# Altium schematic sheet [06] - MICRO CONTROLLER CONNECTORS.SchDoc (part 3 of 3)
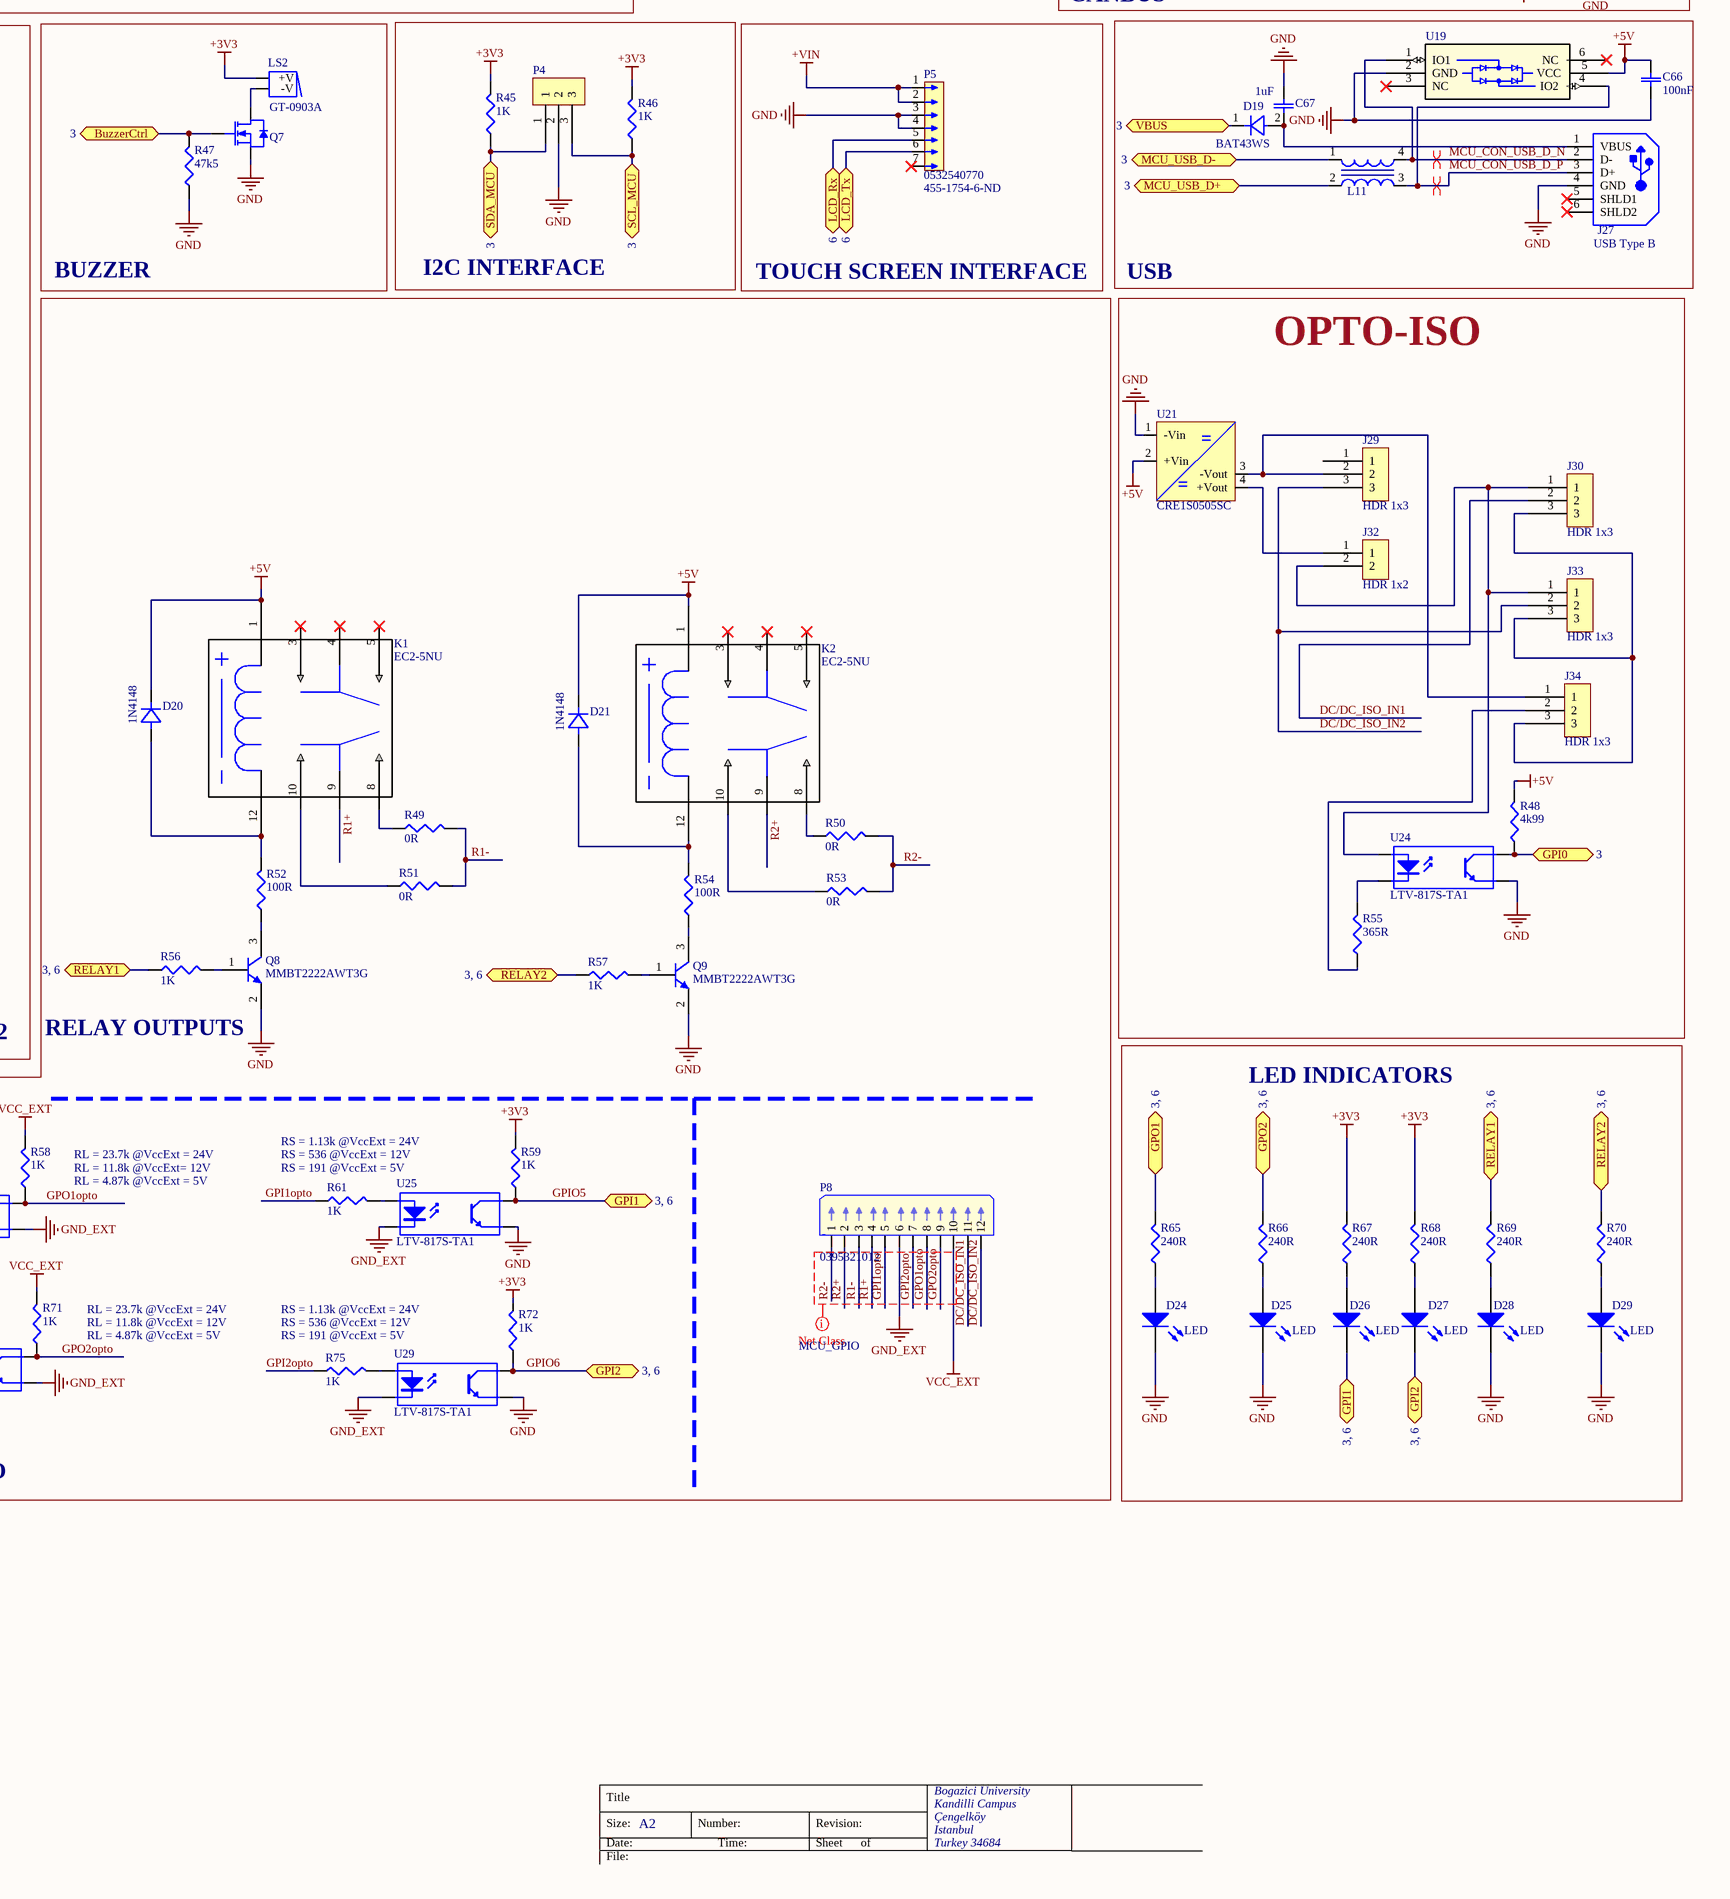
[diagram p5: [06] - MICRO CONTROLLER CONNECTORS.SchDoc, bottom right]

## Library data of the parts (continued)
R59 R61 R62 R71-R73 R75 = ERJ-2RKF1001X: RES SMD 1K OHM 1% 1/10W 0402; Manufacturer 1: Panasonic Electronic Components; Power (Watts): 0.1W, 1/10W; Temperature Coefficient: ±100ppm/°C; Category: Resistors; Package / Case: 0402 (1005 Metric); Tolerance: ±1%; Supplier 1: Digi-Key; Supplier Part Number 1: P1.00KLDKR-ND; RoHS: RoHS Compliant; Stock 1: 18630560; Pricing 1: 1=0.1, 10=0.056, 100=0.0227, 1000=0.01021, 2500=0.00886, 5000=0.00732 (USD); Composition: Thick Film; Features: Automotive AEC-Q200; Size / Dimension: 0.039" L x 0.020" W (1.00mm x 0.50mm); Packaging: Digi-Reel®; ComponentLink1URL: https://industrial.panasonic.com/cdbs/www-data/pdf/RDA0000/AOA0000C304.pdf; ComponentLink1Description: https://industrial.panasonic.com/cdbs/www-data/pdf/RDA0000/AOA0000C304.pdf; Manufacturer Part Number 1: ERJ-2RKF1001X; Part Status: Active; Operating Temperature: -55°C ~ 155°C; Supplier Device Package: 0402; Height - Seated (Max): 0.016" (0.40mm); Failure Rate: -; Description 1: RES SMD 1K OHM 1% 1/10W 0402
R65-R70 = RMCF0402FT240R: RES TF 240 OHM 1% 0.0625W 0402; Manufacturer: Stackpole Electronics Inc; Resistance (Ohms): 240; Power (Watts): 0.063W, 1/16W; .Checked SCH: CHK; Temperature Coefficient: ±100ppm/°C; Category: Resistors; Supplier Part Number: RMCF0402FT240RCT-ND; Manufacturer Part Number: RMCF0402FT240R; Package / Case: 0402 (1005 Metric); Price 1k [$]: 0.00384; Tolerance: ±1%; Value: 240R; Supplier: Digikey; Supplier 1: Digi-Key; Supplier Part Number 1: RMCF0402FT240RCT-ND; RoHS: RoHS Compliant; Stock 1: 39860; Pricing 1: 1=0.04, 10=0.025, 50=0.0138, 100=0.0105, 250=0.0078, 500=0.00576, 1000=0.00384 (USD); Composition: Thick Film; Features: -; Size / Dimension: 0.039" L x 0.020" W (1.00mm x 0.50mm); Height: 0.016" (0.40mm); Number of Terminations: 2; Packaging: Cut Tape (CT); ComponentLink1URL: http://www.seielect.com/Catalog/SEI-RMCF.pdf; ComponentLink1Description: http://www.seielect.com/Catalog/SEI-RMCF.pdf
U18 = SN65HVD1050DR: IC EMC CAN TRANSCEIVER 8-SOIC; Manufacturer: Texas Instruments; Built_By: EMA_UL_Team; C: Copyright (C) 2015 Accelerated Designs. All rights reserved; Protocol: CANbus; Number of Drivers/Receivers: 1/1; Duplex: Half; Voltage - Supply: 4.5 V ~ 5.5 V; .Checked SCH: CHK; Vendor: Texas Instruments; Manufacturer_Part_Number: SN65HVD1050DR; RefDes: RefDes; Type: DEV; Value: Value; Manufacturer 1: Texas Instruments; Manufacturer Part Number 1: SN65HVD1050DR; RoHS: RoHS Compliant; Stock 1: 82774; Pricing 1: 1=1.36, 10=1.215, 100=0.9476, 500=0.7828, 1000=0.618 (USD); Packaging: Cut Tape (CT); Part Status: Active; Data Rate: -; Operating Temperature: -40°C ~ 125°C; Mounting Type: Surface Mount; Package / Case: 8-SOIC (0.154", 3.90mm Width); Supplier Device Package: 8-SOIC; Base Part Number: SN65HVD1050; ComponentLink1URL: http://www.ti.com/lit/ds/symlink/sn65hvd1050.pdf; ComponentLink1Description: http://www.ti.com/lit/ds/symlink/sn65hvd1050.pdf; Supplier 1: Digi-Key; Supplier Part Number 1: 296-26335-1-ND; Description 1: IC EMC CAN TRANSCEIVER 8-SOIC; Category: Integrated Circuits (ICs)
U19 = MAX3207EAUT+T: MAX3207E; Manufacturer 1: Maxim Integrated; Vendor: Maxim Integrated Products; Built_By: EMA_UL_Team; C: Copyright (C) 2015 Accelerated Designs. All rights reserved; Power Line Protection: Yes; Description 1: TVS DIODE SOT23-6; .Checked SCH: CHK; Manufacturer_Part_Number: MAX3207EAUT+T; RefDes: RefDes; Type: DEV; Value: Value; Manufacturer Part Number 1: MAX3207EAUT+T; RoHS: RoHS Compliant; Stock 1: 8902; Pricing 1: 1=1.3, 10=1.224, 25=0.9792, 50=0.9302, 100=0.8568, 250=0.81276, 500=0.78336 (USD); Packaging: Cut Tape (CT); Part Status: Active; Voltage - Reverse Standoff (Typ): -; Voltage - Breakdown (Min): -; Voltage - Clamping (Max) @ Ipp: -; Current - Peak Pulse (10/1000µs): -; Power - Peak Pulse: -; Applications: USB OTG; Capacitance @ Frequency: -; Operating Temperature: -40°C ~ 125°C (TA); Mounting Type: Surface Mount; Package / Case: SOT-23-6; Supplier Device Package: SOT-23-6; Base Part Number: MAX3207E; ComponentLink1URL: https://datasheets.maximintegrated.com/en/ds/MAX3205E-MAX3208E.pdf; ComponentLink1Description: https://datasheets.maximintegrated.com/en/ds/MAX3205E-MAX3208E.pdf; Supplier 1: Digi-Key; Supplier Part Number 1: MAX3207EAUT+TCT-ND; Category: Circuit Protection
U20 = ST3222: ST Dual RS232 Transceiver; Manufacturer 1: STMicroelectronics; Manufacturer Part Number 1: ST3222BTR; .Checked SCH: CHK; Description 1: IC DRIVER/RCVR RS232 LP 20-TSSOP; Number of Drivers/Receivers: 2/2; Duplex: Full; Data Rate: 250kbps; Voltage - Supply: 3 V ~ 3.6 V; Digikey P/N: 497-5845-2-ND; Supplier 1: Digi-Key; RoHS: RoHS Compliant; Category: Integrated Circuits (ICs); Stock 1: 3064; Pricing 1: 1=1.32, 10=1.183, 100=0.9225, 500=0.76206, 1000=0.60162 (USD); Packaging: Digi-Reel®; Part Status: Active; Type: Transceiver; Protocol: RS232; Operating Temperature: -40°C ~ 85°C; Mounting Type: Surface Mount; Package / Case: 20-TSSOP (0.173", 4.40mm Width); Supplier Device Package: 20-TSSOP; Base Part Number: ST3222; ComponentLink1URL: http://www.st.com/content/ccc/resource/technical/document/datasheet/a7/2a/91/f8/35/8c/40/de/CD00002292.pdf/files/CD00002292.pdf/jcr:content/translations/en.CD00002292.pdf; ComponentLink1Description: http://www.st.com/content/ccc/resource/technical/document/datasheet/a7/2a/91/f8/35/8c/40/de/CD00002292.pdf/files/CD00002292.pdf/jcr:content/translations/en.CD00002292.pdf
U21 = CRE1S0505SC: DC/DC TH 1W 5-5V SIP SINGLE; Manufacturer 1: Murata Power Solutions Inc.; Voltage - Input (Min): 4.5V; Voltage - Input (Max): 5.5V; Voltage - Output 1: 5V; Current - Output (Max): 200mA; Efficiency: 70%; .Checked SCH: CHK; Manufacturer Part Number 1: CRE1S0505SC; RoHS: RoHS Compliant; Stock 1: 676; Pricing 1: 1=2.69, 5=2.68, 10=2.66, 25=2.63, 50=2.56, 100=2.43, 250=2.28, 500=2.13002, 1000=2.1147 (USD); Packaging: Tube; Part Status: Active; Type: Isolated Module; Voltage - Output 2: -; Voltage - Output 3: -; Applications: ITE (Commercial); Features: -; Operating Temperature: -40°C ~ 85°C; Mounting Type: Through Hole; Package / Case: 4-SIP Module; Size / Dimension: 0.45" L x 0.24" W x 0.30" H (11.5mm x 6.1mm x 7.5mm); Supplier Device Package: -; ComponentLink1URL: https://power.murata.com/data/power/ncl/kdc_cre1.pdf; ComponentLink1Description: https://power.murata.com/data/power/ncl/kdc_cre1.pdf; Supplier 1: Digi-Key; Supplier Part Number 1: 811-3196-ND; Description 1: DC/DC TH 1W 5-5V SIP SINGLE; Category: Power Supplies - Board Mount
U22 = ST3222: ST Dual RS232 Transceiver; Manufacturer: STMicroelectronics; Manufacturer Part Number: ST3222BTR; Number of Drivers/Receivers: 2/2; Duplex: Full; Data Rate: 250kbps; Voltage - Supply: 3 V ~ 3.6 V; .Checked SCH: CHK; Description 2: IC DRIVER/RCVR RS232 LP 20-TSSOP; Digikey P/N: 497-5845-2-ND; Supplier 1: Digi-Key; RoHS: RoHS Compliant; Category: Integrated Circuits (ICs); Stock 1: 3074; Pricing 1: 1=1.32, 10=1.183, 100=0.9225, 500=0.76206, 1000=0.60162 (USD); Packaging: Cut Tape (CT); Part Status: Active; Type: Transceiver; Protocol: RS232; Operating Temperature: -40°C ~ 85°C; Mounting Type: Surface Mount; Package / Case: 20-TSSOP (0.173", 4.40mm Width); Supplier Device Package: 20-TSSOP; Base Part Number: ST3222; ComponentLink1URL: http://www.st.com/content/ccc/resource/technical/document/datasheet/a7/2a/91/f8/35/8c/40/de/CD00002292.pdf/files/CD00002292.pdf/jcr:content/translations/en.CD00002292.pdf; ComponentLink1Description: http://www.st.com/content/ccc/resource/technical/document/datasheet/a7/2a/91/f8/35/8c/40/de/CD00002292.pdf/files/CD00002292.pdf/jcr:content/translations/en.CD00002292.pdf; Supplier Part Number 1: 497-5845-1-ND; Supplier 2: Digi-Key; Supplier Part Number 2: 497-5845-6-ND; Manufacturer 2: STMicroelectronics; Manufacturer Part Number 2: ST3222BTR; Stock 2: 3064; Pricing 2: 1=1.32, 10=1.183, 100=0.9225, 500=0.76206, 1000=0.60162 (USD)
U23 = ST3222: ST Dual RS232 Transceiver; Manufacturer: STMicroelectronics; Number of Drivers/Receivers: 2/2; Duplex: Full; Data Rate: 250kbps; Voltage - Supply: 3 V ~ 3.6 V; .Checked SCH: CHK; Digikey P/N: 497-5845-2-ND; Supplier 1: Digi-Key; Manufacturer Part Number: ST3222BTR; RoHS: RoHS Compliant; Category: Integrated Circuits (ICs); Stock 1: 3074; Pricing 1: 1=1.32, 10=1.183, 100=0.9225, 500=0.76206, 1000=0.60162 (USD); Packaging: Cut Tape (CT); Part Status: Active; Type: Transceiver; Protocol: RS232; Operating Temperature: -40°C ~ 85°C; Mounting Type: Surface Mount; Package / Case: 20-TSSOP (0.173", 4.40mm Width); Supplier Device Package: 20-TSSOP; Base Part Number: ST3222; ComponentLink1URL: http://www.st.com/content/ccc/resource/technical/document/datasheet/a7/2a/91/f8/35/8c/40/de/CD00002292.pdf/files/CD00002292.pdf/jcr:content/translations/en.CD00002292.pdf; ComponentLink1Description: http://www.st.com/content/ccc/resource/technical/document/datasheet/a7/2a/91/f8/35/8c/40/de/CD00002292.pdf/files/CD00002292.pdf/jcr:content/translations/en.CD00002292.pdf; Supplier Part Number 1: 497-5845-1-ND
U24-U26 U28 U29 = LTV-817S-TA1: OPTOISOLATR 5KV TRANSISTOR 4-SMD; Manufacturer 1: Lite-On Inc.; Voltage - Isolation: 5000Vrms; Current Transfer Ratio (Min): 50% @ 5mA; Current Transfer Ratio (Max): 600% @ 5mA; Rise / Fall Time (Typ): 4µs, 3µs; Input Type: DC; Voltage - Output (Max): 35V; Current - Output / Channel: 50mA; Voltage - Forward (Vf) (Typ): 1.2V; Vce Saturation (Max): 200mV; .Checked SCH: CHK; Supplier 1: Digi-Key; Supplier Part Number 1: 160-1893-6-ND; Manufacturer Part Number 1: LTV-817S-TA1; RoHS: RoHS Compliant; Description 1: OPTOISOLATR 5KV TRANSISTOR 4-SMD; Category: Isolators; Stock 1: 191196; Pricing 1: 1=0.51, 10=0.369, 25=0.3016, 100=0.2411, 250=0.20344, 500=0.1733 (USD); Packaging: Digi-Reel®; Part Status: Active; Turn On / Turn Off Time (Typ): -; Output Type: Transistor; Operating Temperature: -30°C ~ 110°C; Mounting Type: Surface Mount; Package / Case: 4-SMD, Gull Wing; Supplier Device Package: 4-SMD; ComponentLink1URL: http://optoelectronics.liteon.com/upload/download/DS-70-96-0016/LTV-8X7%20series%20201610%20.pdf; ComponentLink1Description: http://optoelectronics.liteon.com/upload/download/DS-70-96-0016/LTV-8X7%20series%20201610%20.pdf
U27 = MAX490: IC TXRX RS485/RS422 8-SOIC; Manufacturer 1: Maxim Integrated; .Checked SCH: CHK; Function: Transceiver; Data Rate: 2.5 Mb/s; Number of Drivers: 1 Driver; Number of Receivers: 1 Receiver; Operating Supply Voltage: 5 V; Operating Supply Current: 300 uA; Duplex: Full Duplex; Input Voltage: 0.8 V to 2 V; Output Voltage: 3 V; Pd - Power Dissipation: 471 mW; Propagation Delay Time: 40 ns, 60 ns; Unit Weight: 0.019048 oz; Supplier 1: RSComponents; Supplier Part Number 1: 7327955; Manufacturer Part Number 1: MAX490ECSA+; Description 1: IC TXRX RS485/RS422 8-SOIC; Stock 1: 37; Pricing 1: 1=2.67, 25=2.59, 100=2.53, 250=2.46, 500=2.4 (EUR); Product Category: RS-422/RS-485 Interface IC; RoHS: True; Maximum Operating Temperature: + 70 C; Minimum Operating Temperature: 0 C; Mounting Style: SMD/SMT; Package / Case: SOIC-8; Packaging: Tube; Brand: Maxim Integrated; Series: MAX490E; Part # Aliases: MAX490E; ComponentLink1URL: https://datasheet.ciiva.com/26835/max490ecsa-26835125.pdf; ComponentLink1Description: https://datasheet.ciiva.com/26835/max490ecsa-26835125.pdf; ComponentLink2URL: https://datasheet.ciiva.com/4786/max1487e-max491e-101921-4786102.pdf; ComponentLink2Description: https://datasheet.ciiva.com/4786/max1487e-max491e-101921-4786102.pdf; ComponentLink3URL: https://datasheet.ciiva.com/1713/max1487e-max491e-1713224.pdf; ComponentLink3Description: https://datasheet.ciiva.com/1713/max1487e-max491e-1713224.pdf; ComponentLink4URL: https://datasheet.ciiva.com/14152/max481e-83e-1487e-eng-tds-14152666.pdf; ComponentLink4Description: https://datasheet.ciiva.com/14152/max481e-83e-1487e-eng-tds-14152666.pdf; ComponentLink5URL: https://datasheet.ciiva.com/16641/max1487e-max491e-16641645.pdf; ComponentLink5Description: https://datasheet.ciiva.com/16641/max1487e-max491e-16641645.pdf; ComponentLink6URL: https://datasheet.ciiva.com/3028/max1487e-max491e-3028671.pdf; ComponentLink6Description: https://datasheet.ciiva.com/3028/max1487e-max491e-3028671.pdf